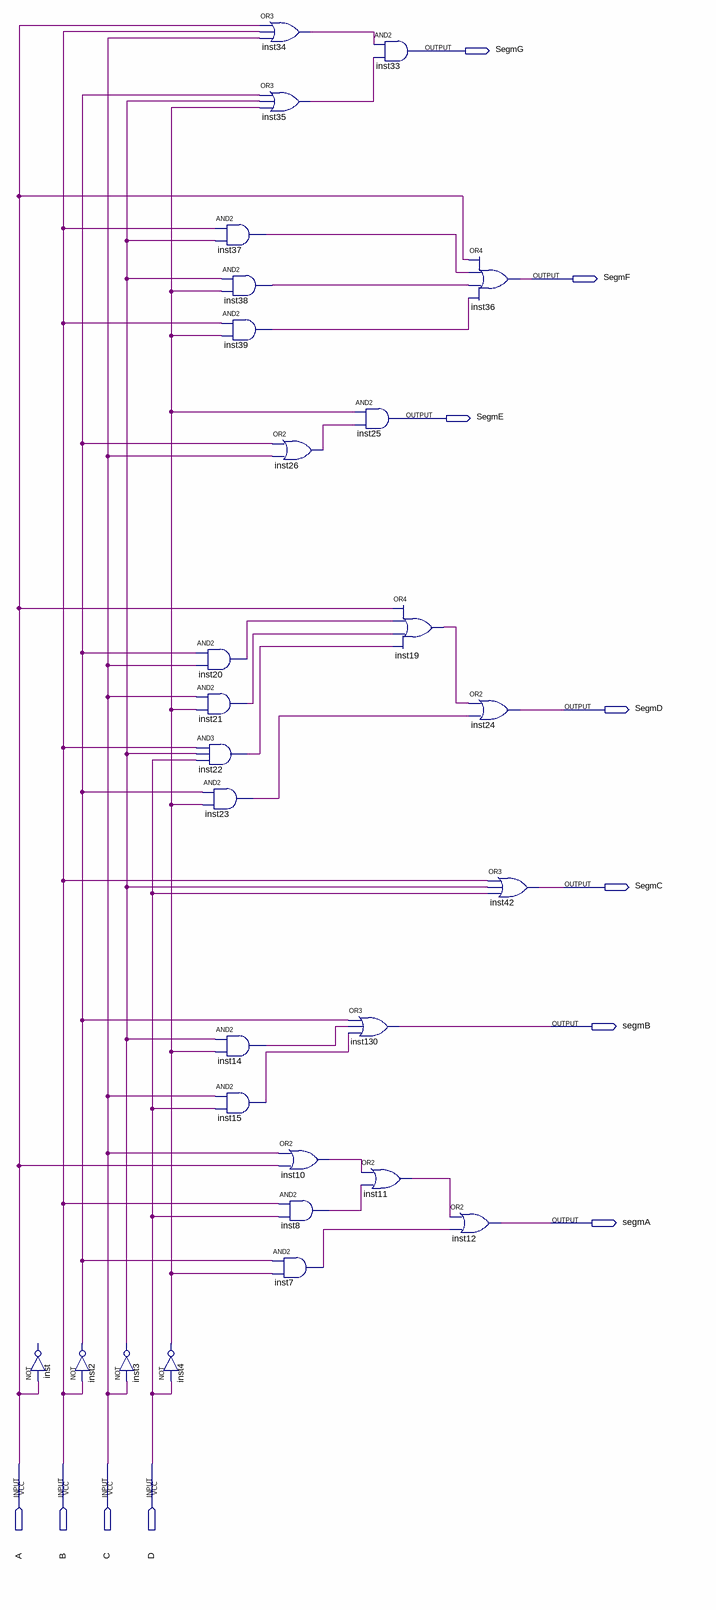
[diagram p0: schematic sheet]
// Quartus schematic display.bdf as structural Verilog: 28 symbols, 11 pins
module display (
  input  A,
  input  B,
  input  C,
  input  D,
  output SegmG,
  output SegmF,
  output SegmE,
  output SegmD,
  output SegmC,
  output segmB,
  output segmA
);

  wire inst2_out, inst3_out, inst4_out, inst7_out, inst8_out, inst10_out, inst11_out, inst14_out, inst15_out,
       inst19_out, inst20_out, inst21_out, inst22_out, inst23_out, inst26_out, inst34_out, inst35_out,
       inst37_out, inst38_out, inst39_out;

  // NOT inst has open pins: IN=A, OUT=open
  not inst2 (inst2_out, B);
  not inst3 (inst3_out, C);
  and inst20 (inst20_out, inst2_out, C);
  and inst21 (inst21_out, C, inst4_out);
  and inst22 (inst22_out, B, inst3_out, D);
  not inst4 (inst4_out, D);
  and inst37 (inst37_out, B, inst3_out);
  and inst38 (inst38_out, inst3_out, inst4_out);
  and inst39 (inst39_out, B, inst4_out);
  and inst23 (inst23_out, inst2_out, inst4_out);
  and inst14 (inst14_out, inst3_out, inst4_out);
  and inst15 (inst15_out, C, D);
  or inst34 (inst34_out, A, B, C);
  or inst35 (inst35_out, inst2_out, inst3_out, inst4_out);
  or inst26 (inst26_out, inst2_out, C);
  or inst10 (inst10_out, C, A);
  and inst8 (inst8_out, B, D);
  and inst7 (inst7_out, inst2_out, inst4_out);
  or inst130 (segmB, inst2_out, inst14_out, inst15_out);
  and inst33 (SegmG, inst34_out, inst35_out);
  and inst25 (SegmE, inst4_out, inst26_out);
  or inst19 (inst19_out, A, inst20_out, inst21_out, inst22_out);
  or inst11 (inst11_out, inst10_out, inst8_out);
  or inst12 (segmA, inst11_out, inst7_out);
  or inst36 (SegmF, A, inst37_out, inst38_out, inst39_out);
  or inst24 (SegmD, inst19_out, inst23_out);
  or inst42 (SegmC, B, inst3_out, D);
endmodule
